# Altium schematic sheet Sheet1.SchDoc
size A4
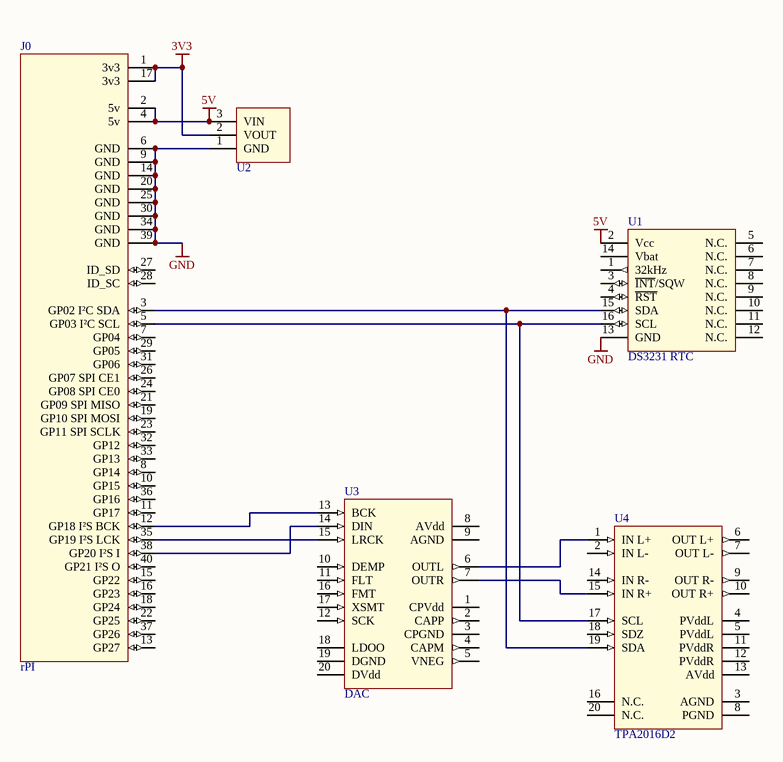
[diagram p0: Sheet1.SchDoc]

## Parts
J0  rPI
U1  DS3231 RTC
U2  MCP1703T-3302E  [SOT-23A]  (value not drawn)
U3  DAC
U4  TPA2016D2

## Nets
3V3: J0.1(3v3) J0.17(3v3) U2.2(VOUT)
5V: J0.2(5v) J0.4(5v) U1.2(Vcc) U2.3(VIN)
GND: J0.6(GND) J0.9(GND) J0.14(GND) J0.20(GND) J0.25(GND) J0.30(GND) J0.34(GND) J0.39(GND) U1.13(GND) U2.1(GND)
NetJ0_3: J0.3(GP02_I²C_SDA) U1.15(SDA) U4.19(SDA)
NetJ0_5: J0.5(GP03_I²C_SCL) U1.16(SCL) U4.17(SCL)
NetJ0_12: J0.12(GP18_I²S_BCK) U3.13(BCK)
NetJ0_35: J0.35(GP19_I²S_LCK) U3.15(LRCK)
NetJ0_38: J0.38(GP20_I²S_I) U3.14(DIN)
NetU3_6: U3.6(OUTL) U4.1(IN_L+)
NetU3_7: U3.7(OUTR) U4.15(IN_R+)

Not connected (* = marked no-connect by the designer): J0 7(GP04) 8(GP14) 10(GP15) 11(GP17) 13(GP27) 15(GP22) 16(GP23) 18(GP24) 19(GP10_SPI_MOSI) 21(GP09_SPI_MISO) 22(GP25) 23(GP11_SPI_SCLK) 24(GP08_SPI_CE0) 26(GP07_SPI_CE1) 27(ID_SD) 28(ID_SC) 29(GP05) 31(GP06) 32(GP12) 33(GP13) 36(GP16) 37(GP26) 40(GP21_I²S_O); U1 1(32kHz) 3(~{INT}/SQW) 4(~{RST}) 5(N.C.) 6(N.C.) 7(N.C.) 8(N.C.) 9(N.C.) 10(N.C.) 11(N.C.) 12(N.C.) 14(Vbat); U3 1(CPVdd) 2(CAPP) 3(CPGND) 4(CAPM) 5(VNEG) 8(AVdd) 9(AGND) 10(DEMP) 11(FLT) 12(SCK) 16(FMT) 17(XSMT) 18(LDOO) 19(DGND) 20(DVdd); U4 2(IN_L-) 3(AGND) 4(PVddL) 5(PVddL) 6(OUT_L+) 7(OUT_L-) 8(PGND) 9(OUT_R-) 10(OUT_R+) 11(PVddR) 12(PVddR) 13(AVdd) 14(IN_R-) 16(N.C.) 18(SDZ) 20(N.C.)

## Library data of the parts
J0 = RaspberryPi_40: RaspberryPi 40 pin connector
U1 = DS3231: RTC build in Xtal
U2 = MCP1703T-3302E: 3v3 power reg
U3 = PCM5102A: PCM5102A DAC
U4 = TPA2016D2RTJR: I²C Controlled Audio Amplifier